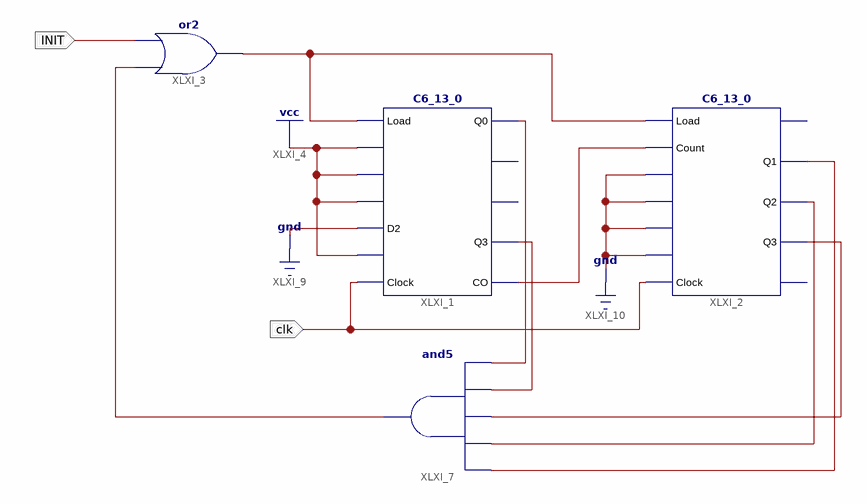
[diagram p0: schematic sheet 1]
// Xilinx ISE schematic C6_13.sch (kintex7) as structural Verilog: 4 symbols, 2 ports
module C6_13 (
  input  INIT,
  input  clk
);

  wire XLXN_2, XLXN_8, XLXN_9, XLXN_10, XLXN_11, XLXN_12, XLXN_13, XLXN_14;

  C6_13_0 XLXI_1 (
    .Load(XLXN_14), .Count(1'b1), .D0(1'b1), .D1(1'b1), .D2(1'b0), .D3(1'b1), .Clock(clk), .Q0(XLXN_8),
    .Q3(XLXN_9), .CO(XLXN_2));  // open: Q1, Q2
  C6_13_0 XLXI_2 (
    .Load(XLXN_14), .Count(XLXN_2), .D0(1'b0), .D1(1'b0), .D2(1'b0), .D3(1'b0), .Clock(clk), .Q1(XLXN_12),
    .Q2(XLXN_11), .Q3(XLXN_10));  // open: Q0, CO
  or XLXI_3 (XLXN_14, XLXN_13, INIT);
  and XLXI_7 (XLXN_13, XLXN_8, XLXN_9, XLXN_10, XLXN_11, XLXN_12);
endmodule
